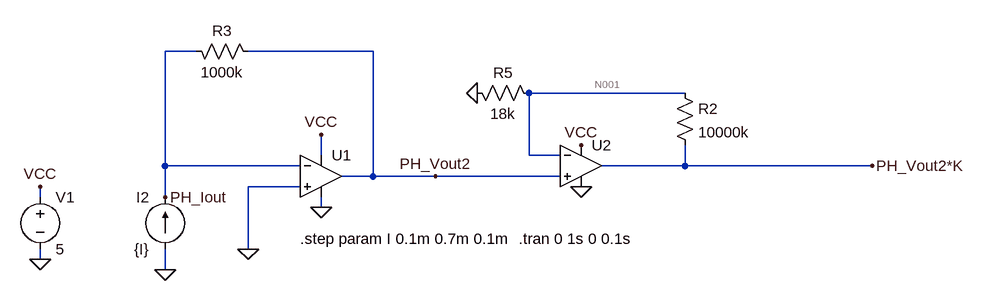
[diagram p0: schematic current_voltage_conventer.asc]
current_voltage_conventer.asc, the LTspice schematic file:
Version 4
SHEET 1 1168 680
WIRE -48 -1040 -96 -1040
WIRE 224 -1040 32 -1040
WIRE 704 -976 464 -976
WIRE 144 -880 144 -912
WIRE 464 -880 464 -976
WIRE 512 -880 464 -880
WIRE -96 -864 -96 -1040
WIRE 112 -864 -96 -864
WIRE 704 -864 704 -896
WIRE 704 -864 576 -864
WIRE 992 -864 704 -864
WIRE 224 -848 224 -1040
WIRE 224 -848 176 -848
WIRE 320 -848 224 -848
WIRE 512 -848 320 -848
WIRE 112 -832 32 -832
WIRE -288 -816 -288 -832
WIRE -96 -816 -96 -864
WIRE 144 -800 144 -816
WIRE 32 -736 32 -832
WIRE -288 -720 -288 -736
WIRE -96 -704 -96 -736
FLAG -288 -720 0
FLAG -288 -832 VCC
FLAG 144 -800 0
FLAG 144 -912 VCC
FLAG -96 -704 0
FLAG 320 -848 PH_Vout2
FLAG -96 -816 PH_Iout
FLAG 32 -736 0
FLAG 544 -896 VCC
FLAG 544 -832 0
FLAG 992 -864 PH_Vout2*K
FLAG 384 -976 0
SYMBOL voltage -288 -832 R0
WINDOW 123 0 0 Left 2
WINDOW 39 0 0 Left 2
SYMATTR InstName V1
SYMATTR Value 5
SYMBOL current -96 -736 R180
WINDOW 0 24 80 Left 2
WINDOW 3 24 0 Left 2
WINDOW 123 0 0 Left 2
WINDOW 39 0 0 Left 2
SYMATTR InstName I2
SYMATTR Value {I}
SYMBOL res 48 -1024 M270
WINDOW 0 32 56 VTop 2
WINDOW 3 0 56 VBottom 2
SYMATTR InstName R3
SYMATTR Value 1000k
SYMBOL res 688 -992 R0
SYMATTR InstName R2
SYMATTR Value 10000k
SYMBOL res 480 -960 M270
WINDOW 0 32 56 VTop 2
WINDOW 3 0 56 VBottom 2
SYMATTR InstName R5
SYMATTR Value 18k
SYMBOL Opamps\\UniversalOpamp2 144 -848 R0
SYMATTR InstName U1
SYMBOL Opamps\\UniversalOpamp2 544 -864 R0
SYMATTR InstName U2
TEXT 448 -752 Left 2 !.tran 0 1s 0 0.1s
TEXT 112 -752 Left 2 !.step param I 0.1m 0.7m 0.1m

The netlist it stands for:
* current_voltage_conventer.asc
V1 VCC 0 5
I2 0 PH_Iout {I}
R3 PH_Vout2 PH_Iout 1000k
R2 N001 PH_Vout2*K 10000k
R5 N001 0 18k
XU1 0 PH_Iout VCC 0 PH_Vout2 level.2 Avol=1Meg GBW=10Meg Slew=10Meg ilimit=25m rail=0 Vos=0 phimargin=45 en=0 enk=0 in=0 ink=0 Rin=500Meg  ; pins IN+ IN- V+ V- OUT
XU2 PH_Vout2 N001 VCC 0 PH_Vout2*K level.2 Avol=1Meg GBW=10Meg Slew=10Meg ilimit=25m rail=0 Vos=0 phimargin=45 en=0 enk=0 in=0 ink=0 Rin=500Meg  ; pins IN+ IN- V+ V- OUT
.tran 0 1s 0 0.1s
.step param I 0.1m 0.7m 0.1m
.lib UniversalOpamps2.sub
.backanno
.end

* Results of the author's LTspice run, read from the files saved beside the schematic
* Operating Point (first step), zero values left out:
*   i = 100 µA
*   V(vcc) = 5 V
*   V(ph_iout) = 99.81 V
*   V(ph_vout2) = 1.096 mV
*   V(n001) = 1.098 mV
*   V(ph_vout2*k) = 561 mV
*   I(I2) = 100 µA
*   I(R5) = 60.99 nA
*   I(R2) = -55.99 nA
*   I(R3) = -99.81 µA
*   I(V1) = -158.4 µA
*   Ix(u1:1) = -5 nA
*   Ix(u1:2) = 194.6 nA
*   Ix(u1:3) = 506 nA
*   Ix(u1:4) = -100.4 µA
*   Ix(u1:5) = 99.81 µA
*   Ix(u2:1) = -4.998 nA
*   Ix(u2:2) = -4.998 nA
*   Ix(u2:3) = 157.9 µA
*   Ix(u2:4) = -157.8 µA
*   Ix(u2:5) = -55.99 nA
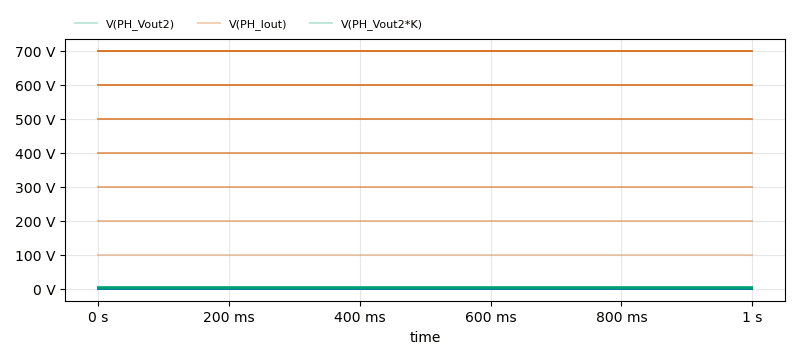
[diagram p1: Transient Analysis of current_voltage_conventer.asc, plotted from the saved traces]
* Transient Analysis, 13 runs:
*   V(PH_Vout2) [run 1]: min 1.096 mV, max 1.096 mV, average 1.096 mV, rms 1.096 mV, last 1.096 mV
*   V(PH_Vout2) [run 2]: 2.186 mV at time=0 s, 2.186 mV at time=0 s, min 2.186 mV, max 2.186 mV
*   V(PH_Vout2) [run 3]: min 2.186 mV, max 2.186 mV, average 2.186 mV, rms 2.186 mV, last 2.186 mV
*   V(PH_Vout2) [run 4]: 3.275 mV at time=0 s, 3.275 mV at time=0 s, min 3.275 mV, max 3.275 mV
*   V(PH_Vout2) [run 5]: min 3.275 mV, max 3.275 mV, average 3.275 mV, rms 3.275 mV, last 3.275 mV
*   V(PH_Vout2) [run 6]: 4.365 mV at time=0 s, 4.365 mV at time=0 s, min 4.365 mV, max 4.365 mV
*   V(PH_Vout2) [run 7]: min 4.365 mV, max 4.365 mV, average 4.365 mV, rms 4.365 mV, last 4.365 mV
*   V(PH_Vout2) [run 8]: 5.455 mV at time=0 s, 5.455 mV at time=0 s, min 5.455 mV, max 5.455 mV
*   V(PH_Iout) [run 1]: min 99.81 V, max 99.81 V, average 99.81 V, rms 99.81 V, last 99.81 V
*   V(PH_Iout) [run 2]: 199.6 V at time=0 s, 199.6 V at time=0 s, min 199.6 V, max 199.6 V
*   V(PH_Iout) [run 3]: min 199.6 V, max 199.6 V, average 199.6 V, rms 199.6 V, last 199.6 V
*   V(PH_Iout) [run 4]: 299.4 V at time=0 s, 299.4 V at time=0 s, min 299.4 V, max 299.4 V
*   V(PH_Iout) [run 5]: min 299.4 V, max 299.4 V, average 299.4 V, rms 299.4 V, last 299.4 V
*   V(PH_Iout) [run 6]: 399.2 V at time=0 s, 399.2 V at time=0 s, min 399.2 V, max 399.2 V
*   V(PH_Iout) [run 7]: min 399.2 V, max 399.2 V, average 399.2 V, rms 399.2 V, last 399.2 V
*   V(PH_Iout) [run 8]: 499 V at time=0 s, 499 V at time=0 s, min 499 V, max 499 V
*   V(PH_Vout2*K) [run 1]: min 561 mV, max 561 mV, average 561 mV, rms 561 mV, last 561 mV
*   V(PH_Vout2*K) [run 2]: 1.167 V at time=0 s, 1.167 V at time=0 s, min 1.167 V, max 1.167 V
*   V(PH_Vout2*K) [run 3]: min 1.167 V, max 1.167 V, average 1.167 V, rms 1.167 V, last 1.167 V
*   V(PH_Vout2*K) [run 4]: 1.773 V at time=0 s, 1.773 V at time=0 s, min 1.773 V, max 1.773 V
*   V(PH_Vout2*K) [run 5]: min 1.773 V, max 1.773 V, average 1.773 V, rms 1.773 V, last 1.773 V
*   V(PH_Vout2*K) [run 6]: 2.38 V at time=0 s, 2.38 V at time=0 s, min 2.38 V, max 2.38 V
*   V(PH_Vout2*K) [run 7]: min 2.38 V, max 2.38 V, average 2.38 V, rms 2.38 V, last 2.38 V
*   V(PH_Vout2*K) [run 8]: 2.986 V at time=0 s, 2.986 V at time=0 s, min 2.986 V, max 2.986 V